# EAGLE schematic ControlIF (EAGLE 6.3)
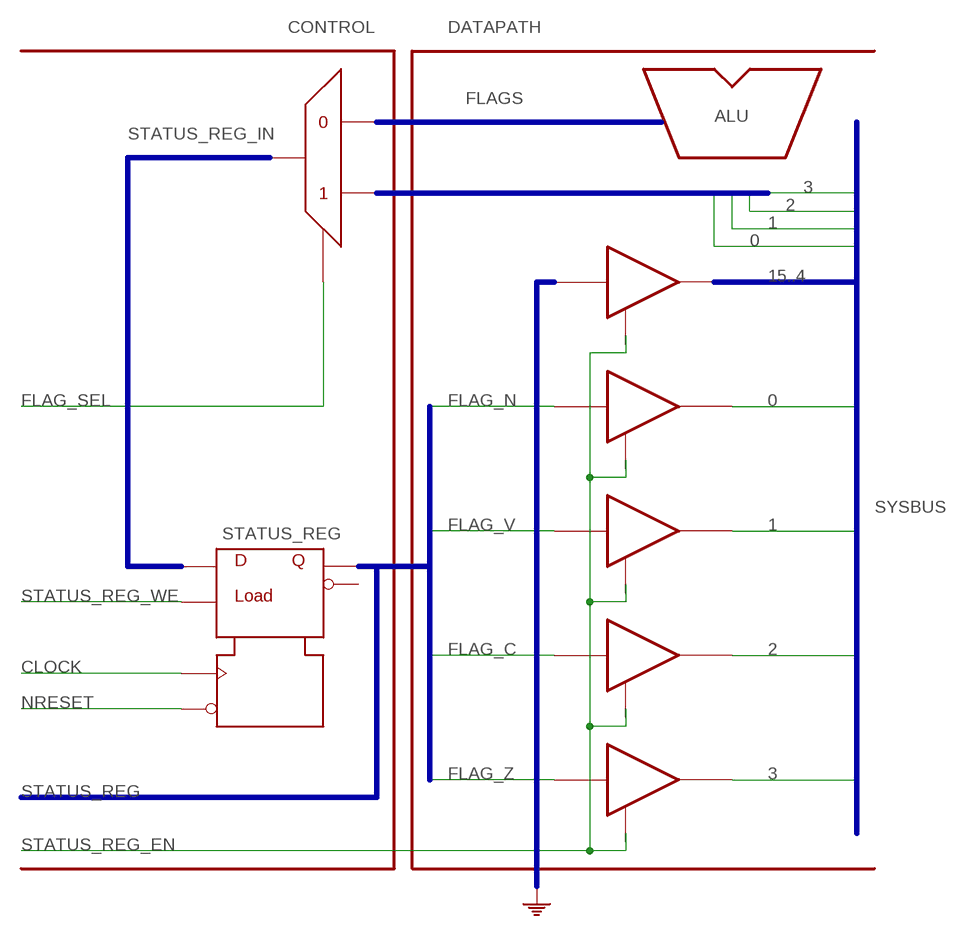
[diagram p0: schematic, sheet 1]

## Parts
MUX2_1  MUX2  [5PIN]
STATUS_REG  SCANREG  [6PIN]
TRISBUF_1  TRISBUF  [3PIN]
TRISBUF_2  TRISBUF  [3PIN]
TRISBUF_3  TRISBUF  [3PIN]
TRISBUF_4  TRISBUF  [3PIN]
TRISBUF_5  TRISBUF  [3PIN]

## Nets
0: TRISBUF_4.P$2(O)
1: TRISBUF_3.P$2(O)
2: TRISBUF_2.P$2(O)
3: TRISBUF_1.P$2(O)
CLOCK: STATUS_REG.P$1(CLOCK)
FLAG_C: TRISBUF_2.P$1(I)
FLAG_SEL: MUX2_1.P$4
FLAG_Z: TRISBUF_1.P$1(I)
NRESET: STATUS_REG.P$5(NRESET)
STATUS_REG_WE: STATUS_REG.P$3(LOAD)
Unconnected: MUX2_1.P$1 MUX2_1.P$2 MUX2_1.P$3 STATUS_REG.P$2(D) STATUS_REG.P$4(NQ) STATUS_REG.P$6(Q) TRISBUF_1.P$3 TRISBUF_2.P$3 TRISBUF_3.P$1(I) TRISBUF_3.P$3 TRISBUF_4.P$1(I) TRISBUF_4.P$3 TRISBUF_5.P$1(I) TRISBUF_5.P$2(O) TRISBUF_5.P$3

## Buses
15..4
B$1
FLAGS
STATUS_REG
STATUS_REG_IN
B$3
SYSBUS

## Notes on the sheet
- CONTROL | DATAPATH
- ALU

## Library data of the parts
MUX2_1 = c035u:MUX2
STATUS_REG = c035u:SCANREG
TRISBUF_1-TRISBUF_5 = c035u:TRISBUF